# Altium schematic sheet bh_sensor_argri_alph.SchDoc
size A4
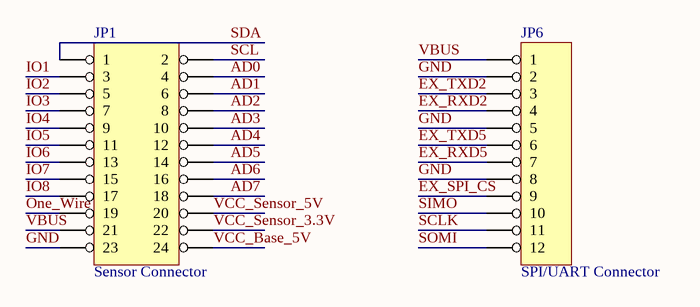
[diagram p0: bh_sensor_argri_alph.SchDoc]

## Parts
JP1  Sensor Connector  [SIP2X12X2.54]
JP6  SPI/UART Connector  [SIP1x12x2.54]

## Nets
AD0: JP1.4
AD1: JP1.6
AD2: JP1.8
AD3: JP1.10
AD4: JP1.12
AD5: JP1.14
AD6: JP1.16
AD7: JP1.18
EX_RXD2: JP6.4
EX_RXD5: JP6.7
EX_SPI_CS: JP6.9
EX_TXD2: JP6.3
EX_TXD5: JP6.6
GND: JP1.23 JP6.2 JP6.5 JP6.8
IO1: JP1.3
IO2: JP1.5
IO3: JP1.7
IO4: JP1.9
IO5: JP1.11
IO6: JP1.13
IO7: JP1.15
IO8: JP1.17
One_Wire: JP1.19
SCL: JP1.2
SCLK: JP6.11
SDA: JP1.1
SIMO: JP6.10
SOMI: JP6.12
VBUS: JP1.21 JP6.1
VCC_Base_5V: JP1.24
VCC_Sensor_3.3V: JP1.22
VCC_Sensor_5V: JP1.20

## Library data of the parts
JP1 = SIP2X12
JP6 = SIP1X12: 12 Pin Header